# Altium schematic sheet Stepper Motor Driver.SchDoc
size A4
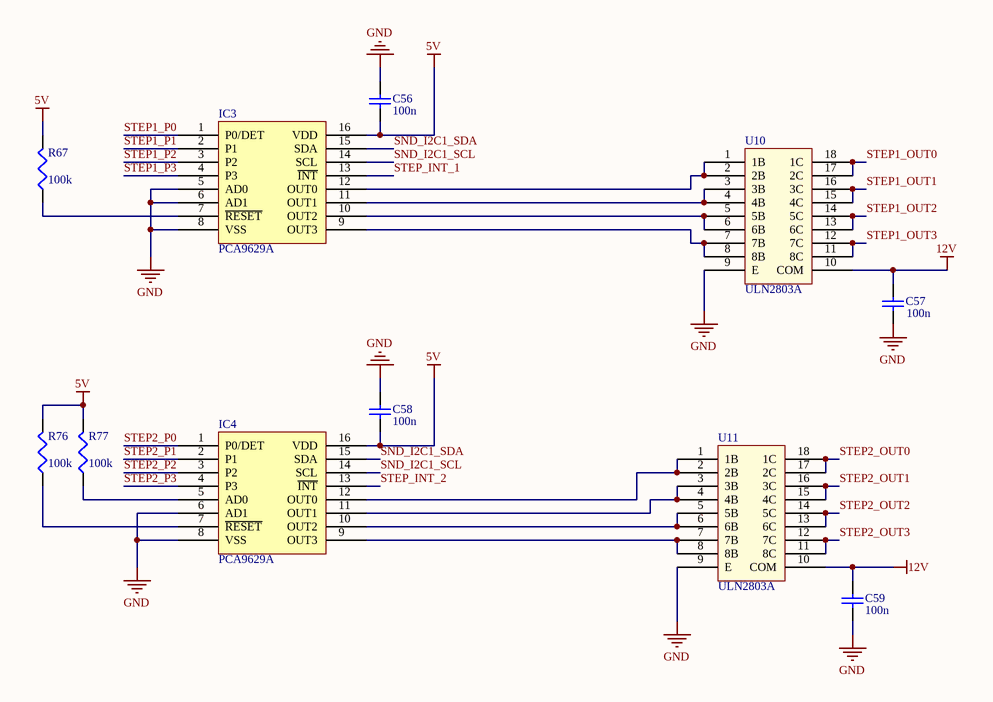
[diagram p0: Stepper Motor Driver.SchDoc]

## Parts
C56  value 100n  [0805C-GENERIC]  (hidden comment: Cap Semi)
C57  value 100n  [0805C-GENERIC]  (hidden comment: Cap Semi)
C58  value 100n  [0805C-GENERIC]  (hidden comment: Cap Semi)
C59  value 100n  [0805C-GENERIC]  (hidden comment: Cap Semi)
IC3  PCA9629A  [TSSOP16]
IC4  PCA9629A  [TSSOP16]
R67  value 100k  [0805R-GENERIC]  (hidden comment: Res3)
R76  value 100k  [0805R-GENERIC]  (hidden comment: Res3)
R77  value 100k  [0805R-GENERIC]  (hidden comment: Res3)
U10  ULN2803A  [SOIC18]
U11  ULN2803A  [SOIC18]

## Nets
5V: C56.1 C58.1 IC3.16(VDD) IC4.16(VDD) R67.2 R76.2 R77.2
12V: C57.2 C59.2 U10.10(COM) U11.10(COM)
GND: C56.2 C57.1 C58.2 C59.1 IC3.5(AD0) IC3.6(AD1) IC3.8(VSS) IC4.6(AD1) IC4.8(VSS) U10.9(E) U11.9(E)
SND_I2C1_SCL: IC3.14(SCL) IC4.14(SCL)
SND_I2C1_SDA: IC3.15(SDA) IC4.15(SDA)
STEP1_OUT0: U10.17(2C) U10.18(1C)
STEP1_OUT1: U10.15(4C) U10.16(3C)
STEP1_OUT2: U10.13(6C) U10.14(5C)
STEP1_OUT3: U10.11(8C) U10.12(7C)
STEP1_P0: IC3.1(P0/DET)
STEP1_P1: IC3.2(P1)
STEP1_P2: IC3.3(P2)
STEP1_P3: IC3.4(P3)
STEP2_OUT0: U11.17(2C) U11.18(1C)
STEP2_OUT1: U11.15(4C) U11.16(3C)
STEP2_OUT2: U11.13(6C) U11.14(5C)
STEP2_OUT3: U11.11(8C) U11.12(7C)
STEP2_P0: IC4.1(P0/DET)
STEP2_P1: IC4.2(P1)
STEP2_P2: IC4.3(P2)
STEP2_P3: IC4.4(P3)
STEP_INT_1: IC3.13(~{INT})
STEP_INT_2: IC4.13(~{INT})
NetIC3_7: IC3.7(~{RESET}) R67.1
NetIC3_9: IC3.9(OUT3) U10.7(7B) U10.8(8B)
NetIC3_10: IC3.10(OUT2) U10.5(5B) U10.6(6B)
NetIC3_11: IC3.11(OUT1) U10.3(3B) U10.4(4B)
NetIC3_12: IC3.12(OUT0) U10.1(1B) U10.2(2B)
NetIC4_5: IC4.5(AD0) R77.1
NetIC4_7: IC4.7(~{RESET}) R76.1
NetIC4_9: IC4.9(OUT3) U11.7(7B) U11.8(8B)
NetIC4_10: IC4.10(OUT2) U11.5(5B) U11.6(6B)
NetIC4_11: IC4.11(OUT1) U11.3(3B) U11.4(4B)
NetIC4_12: IC4.12(OUT0) U11.1(1B) U11.2(2B)

## Library data of the parts
C56-C59 = Cap Semi: Capacitor (Semiconductor SIM Model); Published: 8-Jun-2000; LatestRevisionDate: 29-May-2009; LatestRevisionNote: IPC-7351 Footprint Added.; PackageReference: C1206; Publisher: Altium Limited; PackageDescription: Chip Capacitor
IC3 IC4 = PCA9629A: Fm+ I2C-bus advanced stepper motor controller
R67 R76 R77 = Res3: Resistor; Published: 8-Jun-2000; LatestRevisionDate: 29-May-2009; LatestRevisionNote: IPC-7351 Footprint Added.; PackageReference: J1-0603; Publisher: Altium Limited; PackageDescription: Chip Resistor